# EAGLE design 2x4_v1 (EAGLE 5.06)
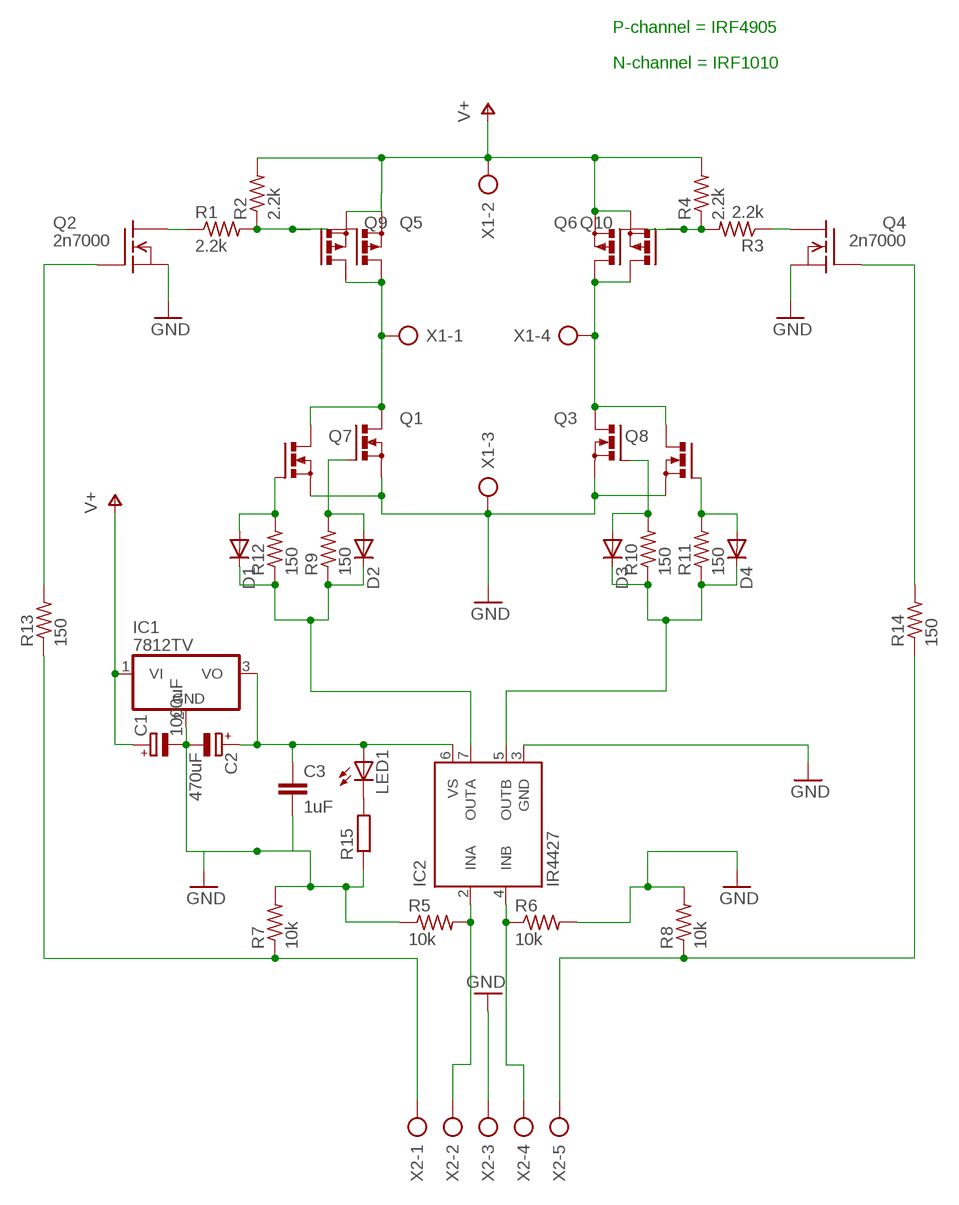
[diagram p0: schematic, sheet 1]

## Parts
C1  1000uF  CPOL-EUE5-8.5  [E5-8,5]
C2  470uF  CPOL-EUE5-8.5  [E5-8,5]
C3  1uF  C-EU025-024X044  [C025-024X044]
D1  d914  DIODE1N4148  [DIODE-1N4148]
D2  d914  DIODE1N4148  [DIODE-1N4148]
D3  d914  DIODE1N4148  [DIODE-1N4148]
D4  d914  DIODE1N4148  [DIODE-1N4148]
IC1  7812TV  [TO220V]
IC2  IR4427  [DIL08]
LED1  LED3MM  [LED3MM]
Q1  PMOSFET_NTO220BV  [TO220BV]
Q2  2n7000  VN0106N9  [TO-52]
Q3  PMOSFET_NTO220BV  [TO220BV]
Q4  2n7000  VN0106N9  [TO-52]
Q5  PMOSFET_PTO220BV  [TO220BV]
Q6  PMOSFET_PTO220BV  [TO220BV]
Q7  PMOSFET_NTO220BV  [TO220BV]
Q8  PMOSFET_NTO220BV  [TO220BV]
Q9  PMOSFET_PTO220BV  [TO220BV]
Q10  PMOSFET_PTO220BV  [TO220BV]
R1  2.2k  R-US_0204/5  [0204/5]
R2  2.2k  R-US_0204/7  [0204/7]
R3  2.2k  R-US_0204/5  [0204/5]
R4  2.2k  R-US_0204/7  [0204/7]
R5  10k  R-US_0204/5  [0204/5]
R6  10k  R-US_0204/5  [0204/5]
R7  10k  R-US_0204/7  [0204/7]
R8  10k  R-US_0204/7  [0204/7]
R9  150  R-US_0204/7  [0204/7]
R10  150  R-US_0204/7  [0204/7]
R11  150  R-US_0204/7  [0204/7]
R12  150  R-US_0204/7  [0204/7]
R13  150  R-US_0204/7  [0204/7]
R14  150  R-US_0204/7  [0204/7]
R15  R-EU_0204/5  [0204/5]
X1  AK500/4  [AK500/4]
X2  AK500/5  [AK500/5]

## Nets
GND: C1.- C2.- C3.2 IC1.2(GND) IC2.3(GND) Q1.S Q2.1(S) Q3.S Q4.1(S) Q7.S Q8.S R5.1 R6.2 R7.2 R8.2 R15.1 X1.3 X2.3
N$1: Q4.2(G) R14.2
N$2: Q5.G Q9.G R1.2 R2.1
N$3: Q6.G Q10.G R3.2 R4.1
N$5: Q1.D Q5.D Q7.D Q9.D X1.1
N$6: Q3.D Q6.D Q8.D Q10.D X1.4
N$7: Q2.3(D) R1.1
N$9: Q4.3(D) R3.1
N$10: R7.1 R13.1 X2.1
N$11: R8.1 R14.1 X2.5
N$12: IC2.4(INB) R6.1 X2.4
N$13: IC2.2(INA) R5.2 X2.2
N$14: D2.A Q1.G R9.2
N$16: C2.+ C3.1 IC1.3(VO) IC2.6(VS) LED1.A
N$17: D3.A Q3.G R10.2
N$18: D3.C D4.C IC2.5(OUTB) R10.1 R11.1
N$19: D1.C D2.C IC2.7(OUTA) R9.1 R12.1
N$20: D1.A Q7.G R12.2
N$21: D4.A Q8.G R11.2
N$22: LED1.K(C) R15.2
N$24: Q2.2(G) R13.2
V+: C1.+ IC1.1(VI) Q5.S Q6.S Q9.S Q10.S R2.2 R4.2 X1.2

## Notes on the sheet
- P-channel = IRF4905
- N-channel = IRF1010

## Library data of the parts
C1 C2 = rcl:CPOL-EU: POLARIZED CAPACITOR, European symbol
C3 = rcl:C-EU: CAPACITOR, European symbol
D1-D4 = SparkFun:DIODE: Diode These are standard reverse protection diodes and small signal diodes. SMA package can handle up to about 1A. SOD-323 can handle about 200mA. What the SOD-323 package when ordering, there are some mfgs out there that are 5-pin packages.
IC1 = linear:78*: Positive VOLTAGE REGULATOR Source: http://cache.national.com/ds/LM/LM78L05.pdf http://www.fairchildsemi.com/ds/LM/LM7805.pdf
IC2 = ir:IR4427: DUAL LOW SIDE DRIVER Source: ID4426.pdf
LED1 = SparkFun:LED: LEDs Standard schematic elements and footprints for 5mm, 3mm, 1206, and 0603 sized LEDs. 5mm - Spark Fun Electronics SKU : COM-00529 (and others)
Q1 Q3 Q7 Q8 = transistor-power:PMOSFET_N: Power MOSFET N-Channel
Q2 Q4 = transistor-fet:VN0106N9: N-Channel Enhancement MOSFET 60V; 0,5A; 3,0Ohm
Q5 Q6 Q9 Q10 = transistor-power:PMOSFET_P: Power MOSFET P-Channel
R1-R4 R7 R13 = resistor:R-US_: RESISTOR, American symbol
R5 R6 R8-R12 R14 = rcl:R-US_: RESISTOR, American symbol
R15 = resistor:R-EU_: RESISTOR, European symbol
X1 = con-ptr500:AK500/4: CONNECTOR
X2 = con-ptr500:AK500/5: CONNECTOR

## Board
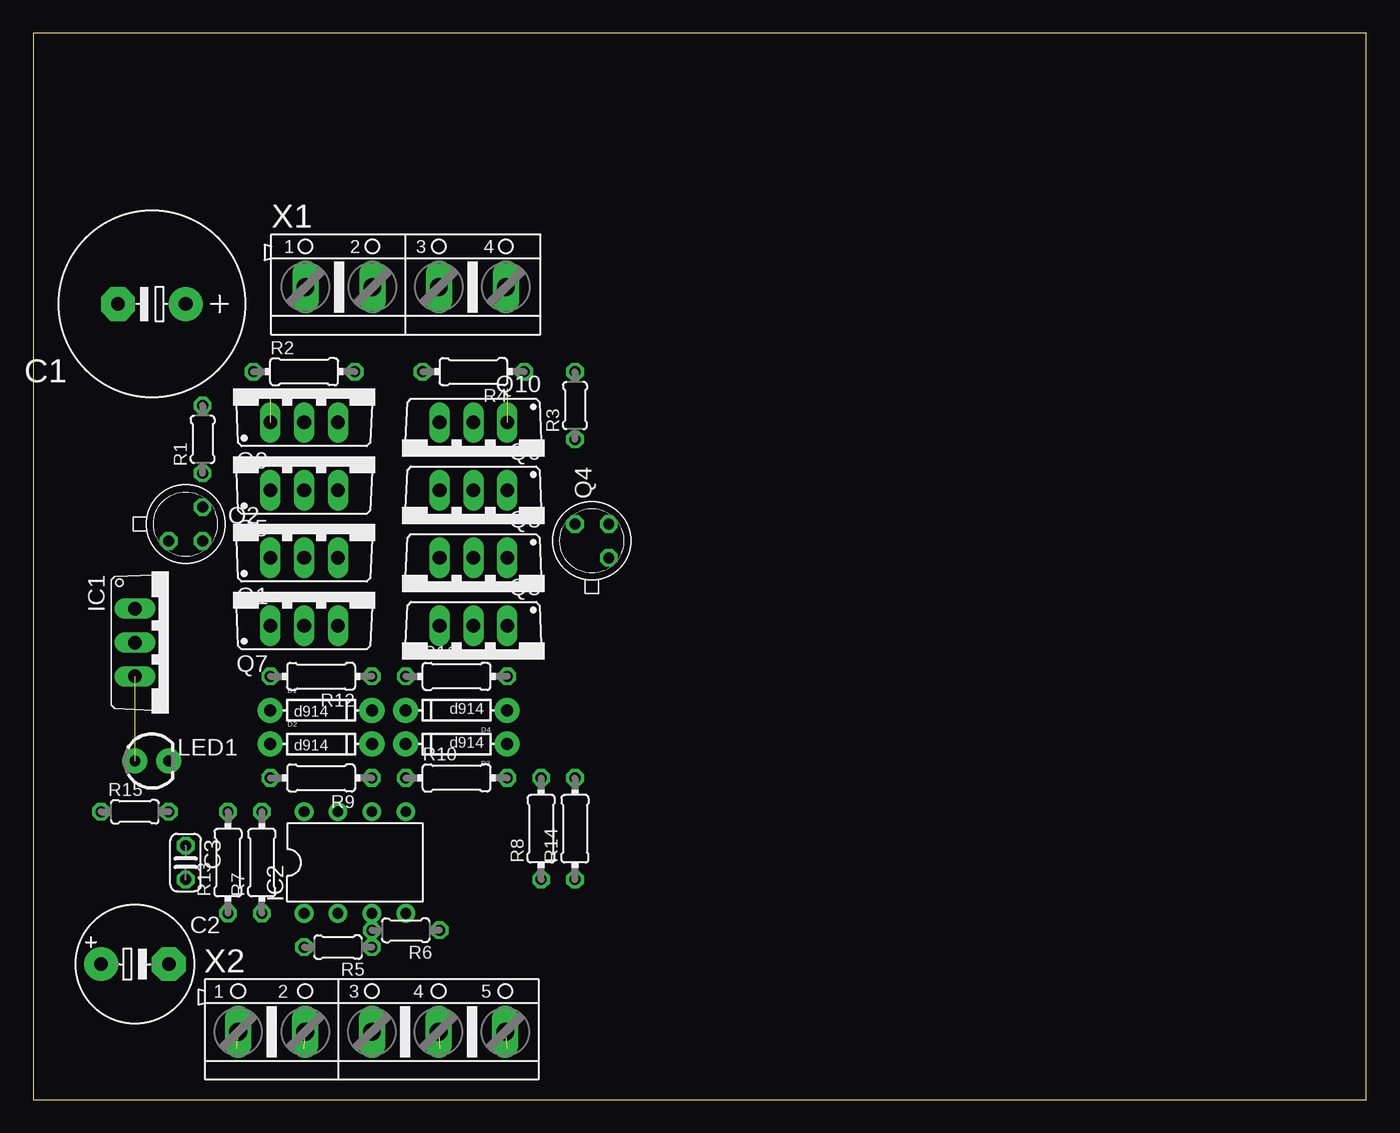
[diagram p1: board, top side]
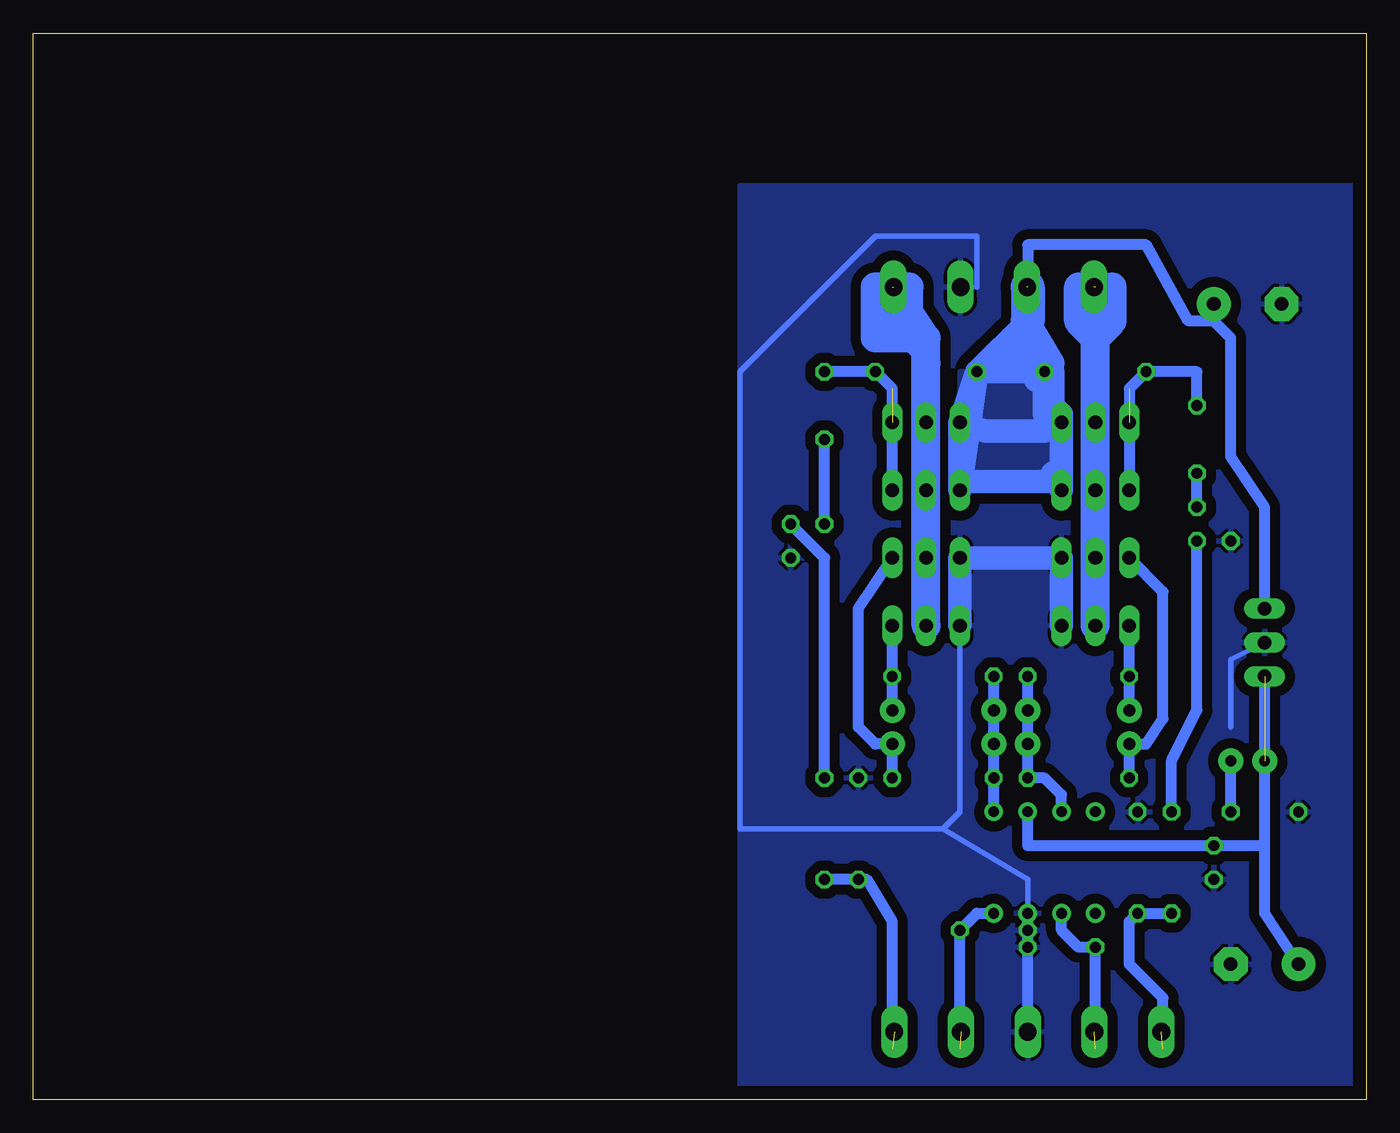
[diagram p2: board, bottom side, seen from below]

Size 100 x 80 mm. Coordinates in mm from the lower left corner, seen from the top.
Outline: 0,0 100,0 100,80 0,80 0,0
Copper layers (1*16): Top 0.035mm / dielectric 1.5mm / Bottom 0.035mm
Design rules "default *": minimum track width 10mil, minimum drill 24mil, track to track 30mil, track to pad 30mil, pad to pad 8mil, via to via 8mil, smd to smd 8mil, copper to edge 40mil, drill to drill 8mil, minimum pad ring 10mil, minimum via ring 8mil, stop-mask expansion 4mil, vias tented up to drill 0mil, thermal gap 10mil

### Footprints (pad centres in the part's own frame; a part is rotated, then mirrored left to right if it is on the bottom)
E5-13 = drill 1.016 pad 2.54 round: + -2.54,0 | drill 1.016 pad 2.54 octagon: - 2.54,0
E5-8,5 = drill 1.016 pad 2.54 round: + -2.54,0 | drill 1.016 pad 2.54 octagon: - 2.54,0
C025-024X044 = drill 0.813 octagon: 1 -1.27,0; 2 1.27,0
DIODE-1N4148 = drill 0.9 pad 1.88 round: A -3.81,0; C 3.81,0
TO220V = drill 1.016 long: 1 -2.54,-2.54; 2 0,-2.54; 3 2.54,-2.54
DIL08 = drill 0.8 pad 1.4 round: 1 -3.81,-3.81; 2 -1.27,-3.81; 3 1.27,-3.81; 4 3.81,-3.81; 5 3.81,3.81; 6 1.27,3.81; 7 -1.27,3.81; 8 -3.81,3.81
LED3MM = drill 0.813 pad 1.88 round: A -1.27,0; K 1.27,0
TO220BV = drill 1.016 long: D 0,-2.54; G -2.54,-2.54; S 2.54,-2.54
TO-52 = drill 0.813 octagon: 1 -1.27,-1.27; 2 1.27,-1.27; 3 1.27,1.27
0204/5 = drill 0.813 octagon: 1 -2.54,0; 2 2.54,0
0204/7 = drill 0.813 octagon: 1 -3.81,0; 2 3.81,0
AK500/4 = drill 1.321 long: 1 -7.518,0; 2 -2.489,0; 3 2.489,0; 4 7.518,0
AK500/5 = drill 1.321 long: 1 -10.033,0; 2 -5.004,0; 3 0,0; 4 5.004,0; 5 10.008,0

### Placement (x,y rotation side)
C1  1000uF  [E5-13]  8.89,59.69 180 top
C2  7.62,10.16 0 top
C3  11.43,17.78 270 top
D1  21.59,29.21 0 top
D2  21.59,26.67 0 top
D3  31.75,26.67 180 top
D4  31.75,29.21 180 top
IC1  10.16,34.29 270 top
IC2  24.13,17.78 0 top
LED1  8.89,25.4 0 top
Q1  20.32,43.18 0 top
Q2  11.43,43.18 0 top
Q3  33.02,38.1 180 top
Q4  41.91,41.91 90 top
Q5  20.32,48.26 0 top
Q6  33.02,43.18 180 top
Q7  20.32,38.1 0 top
Q8  33.02,33.02 180 top
Q9  20.32,53.34 0 top
Q10  33.02,48.26 180 top
R1  12.7,49.53 90 top
R2  20.32,54.61 0 top
R3  40.64,52.07 90 top
R4  33.02,54.61 180 top
R5  22.86,11.43 180 top
R6  27.94,12.7 180 top
R7  17.14,17.78 90 top
R8  38.1,20.32 90 top
R9  21.59,24.13 180 top
R10  31.75,24.13 0 top
R11  31.75,31.75 0 top
R12  21.59,31.75 180 top
R13  14.61,17.78 90 top
R14  40.64,20.32 90 top
R15  7.62,21.59 0 top
X1  27.94,60.96 0 top
X2  25.4,5.08 0 top

### Tracks (layer width: path | path; a pad name or v marks a point on that pad's centre or on a via)
GND
  Bottom 0.406: IC2.3 25.4,16.51 31.75,20.32 | 29.21,60.96 29.21,64.77 36.83,64.77 46.99,54.61 46.99,20.32 31.75,20.32 | 10.16,27.94 10.16,33.02 IC1.2 | Q8.S 30.48,21.59 31.75,20.32
  Bottom 0.813: IC2.3 R5.1 X2.3
  Bottom 1.778: Q7.S Q1.S Q3.S Q8.S
  pour Bottom: 0,68.58 46.99,68.58 46.99,0 0,0
N$1
  Bottom 0.813: R14.2 40.64,40.64 Q4.2
N$2  (1 unrouted)
  Bottom 0.813: R1.2 12.7,54.61 R2.1 17.78,53.34 Q5.G
N$3  (1 unrouted)
  Bottom 0.813: Q6.G 35.56,53.34 R4.1 R3.2
N$5  (1 unrouted)
  Bottom 1.778: Q7.D Q1.D Q5.D Q9.D 20.32,57.15
  Bottom 2.184: Q7.D 20.32,57.15 | 20.32,57.15 20.32,60.96 | 20.32,60.96 19.05,60.96 19.05,58.42 20.32,57.15 | 20.32,57.15 21.59,58.42 21.59,60.96 20.32,60.96
N$6  (1 unrouted)
  Bottom 1.778: Q8.D Q3.D Q6.D Q10.D 33.02,55.24 33.02,55.88 34.92,57.78
  Bottom 2.184: 33.02,57.15 35.56,60.96 | Q8.D 33.02,55.24 33.02,57.15 | 35.56,60.96 34.29,60.96 34.29,57.15 33.02,57.15 | 33.02,57.15 36.83,57.15 36.83,60.96 35.56,60.96 | 35.56,60.96 35.56,58.42
N$7
  Bottom 0.813: Q2.3 R1.1
N$9
  Bottom 0.813: Q4.3 R3.1
N$10  (1 unrouted)
  Bottom 0.813: R7.1 R13.1 R7.1 | R7.1 17.78,13.34 17.78,10.16 15.24,7.62 15.24,3.81
N$11  (1 unrouted)
  Bottom 0.813: R8.1 R14.1 R8.1 | 35.56,3.81 35.56,13.34 37.47,16.51 R8.1
N$12  (1 unrouted)
  Bottom 0.813: IC2.4 29.21,13.97 R6.1 30.48,3.81
N$13  (1 unrouted)
  Bottom 0.813: IC2.2 22.86,12.7 21.59,11.43 R5.2 20.32,3.81
N$14
  Bottom 0.813: Q1.G 15.24,38.1 15.24,28.57 16.51,26.67 D2.A R9.2
N$16  (1 unrouted)
  Bottom 0.813: IC2.6 25.4,19.05 C3.1 7.62,19.05 | C2.+ 7.62,13.97 7.62,19.05 | 7.62,19.05 IC1.3
N$17
  Bottom 0.813: Q3.G 38.1,36.83 38.1,27.94 36.83,26.67 D3.A R10.2
N$18
  Bottom 0.813: IC2.5 R10.1 D3.C D4.C R11.1
N$19
  Bottom 0.813: IC2.7 22.86,22.86 24.13,24.13 R9.1 D2.C D1.C R12.1
N$20
  Bottom 0.813: Q7.G R12.2 D1.A
N$21
  Bottom 0.813: Q8.G R11.2 D4.A
N$22
  Bottom 0.813: R15.2 LED1.K
N$24
  Bottom 0.813: R13.2 14.61,25.4 12.7,29.21 Q2.2
V+  (1 unrouted)
  Bottom 0.406: Q6.S Q5.S | R2.2 23.5,55.24 | 25.4,55.88 29.21,55.24 R4.2
  Bottom 0.813: 11.43,58.42 13.34,58.42 16.51,64.14 25.4,64.14 25.4,60.96 | IC1.1 7.62,44.45 10.16,48.26 10.16,57.15 11.43,58.42 | 11.43,58.42 C1.+
  Bottom 1.778: R4.2 Q6.S 30.48,46.35 | R2.2 24.77,53.98 | R2.2 24.13,51.44 Q9.S | Q9.S 22.86,46.35 | Q5.S 22.86,46.35 | 25.4,58.42 R2.2 | Q10.S 30.48,46.35 | Q10.S 28.57,50.16 24.13,50.16 23.5,50.8 Q9.S | R4.2 Q10.S | 25.4,58.42 23.5,55.24 25.4,55.88 25.4,57.15 25.4,58.42 | 25.4,58.42 R4.2 | R4.2 26.67,57.15 | 26.67,57.15 26.04,57.78 | 26.67,57.15 26.67,55.88 27.94,54.61 R4.2 | Q9.S 22.86,51.44 23.5,52.07 23.5,54.61 R4.2 | 30.48,46.35 22.86,46.35 | 22.86,46.35 23.5,46.99
  Bottom 2.184: 25.4,60.96 25.4,57.15
  Bottom 2.54: 25.4,60.96 25.4,58.42
  pour Bottom: 22.86,55.24 22.86,45.72 30.48,45.72 30.48,54.61 27.3,55.24